# EAGLE design samd21_sensorhub_Lite_TQFP32_1.2.0_feb2023 (EAGLE 9.6.2)
MODEL: SensorHub Lite; VERSION: V1.1.2 Feb 2023

## Sheet 1 of 2
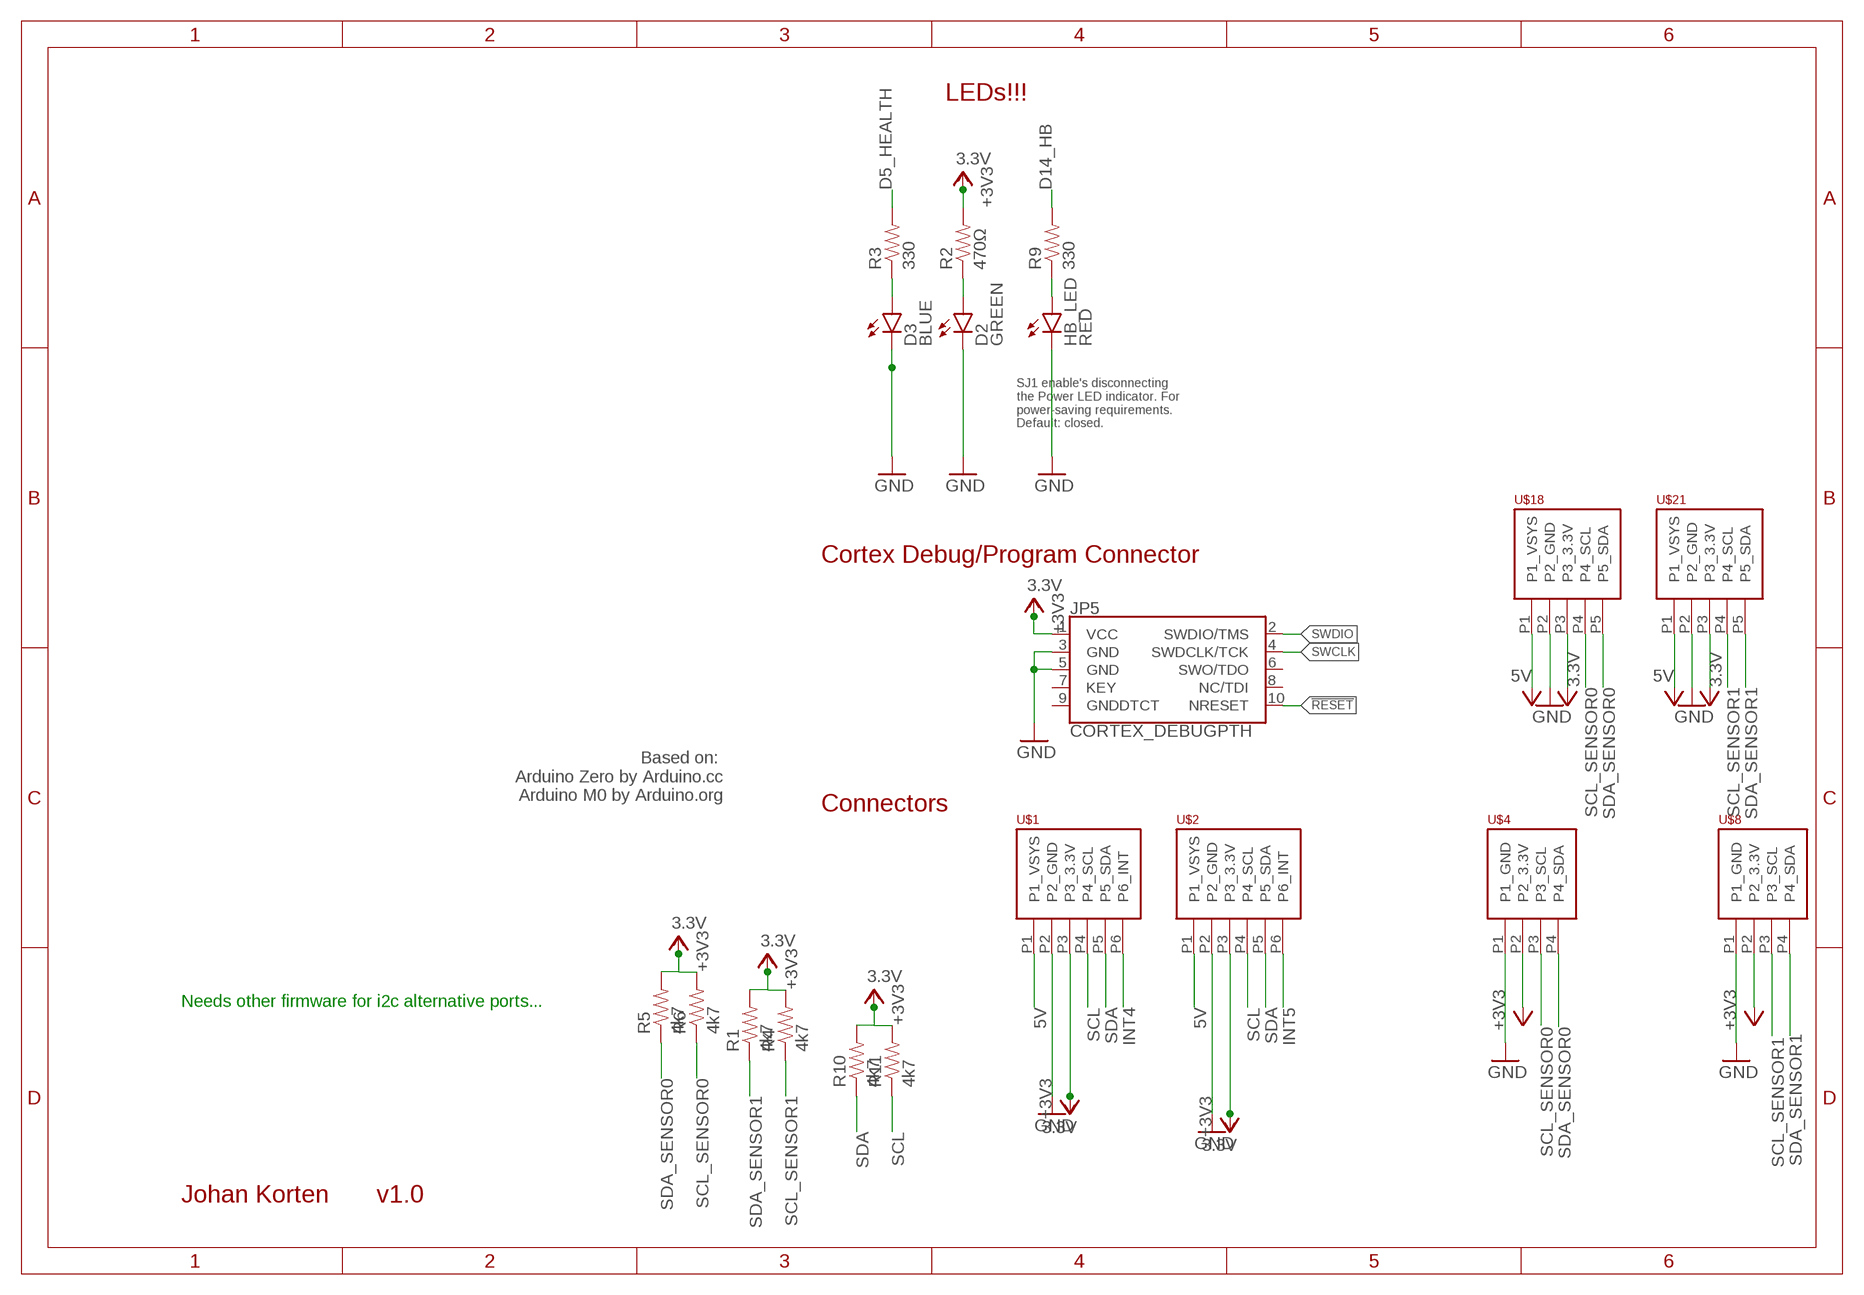
[diagram p0: schematic, sheet 1]

### Parts
D2  GREEN  LED-RED0603  [LED-0603]
D3  BLUE  LED-BLUE0603  [LED-0603]
HB_LED  RED  LED-RED0603  [LED-0603]
JP5  CORTEX_DEBUGPTH  [2X5-PTH-1.27MM]
R1  4k7  330OHM1/10W1%(0603)  [0603-RES]
R2  470Ω  330OHM1/10W1%(0603)  [0603-RES]
R3  330  330OHM1/10W1%(0603)  [0603-RES]
R4  4k7  330OHM1/10W1%(0603)  [0603-RES]
R5  4k7  330OHM1/10W1%(0603)  [0603-RES]
R6  4k7  330OHM1/10W1%(0603)  [0603-RES]
R9  330  330OHM1/10W1%(0603)  [0603-RES]
R10  4k7  330OHM1/10W1%(0603)  [0603-RES]
R11  4k7  330OHM1/10W1%(0603)  [0603-RES]
U$1  PHOENIX_PTSM_M6_TH_I2CPPANGLE  [PTSM_M6_THRHOLE]
U$2  PHOENIX_PTSM_M6_TH_I2CPPANGLE  [PTSM_M6_THRHOLE]
U$4  PHOENIX_PTSM_M4_THANGLE  [PTSM_M4_TH]
U$8  PHOENIX_PTSM_M4_THANGLE  [PTSM_M4_TH]
U$18  PHOENIX_PTSM_M5_TH_I2C++  [PTSM_M5_THRHOLE]
U$21  PHOENIX_PTSM_M5_TH_I2C++  [PTSM_M5_THRHOLE]

### Nets
3.3V [power]: JP5.1(VCC) R1.2 R2.2 R4.2 R5.2 R6.2 R10.2 R11.2 U$1.P3(P3_3.3V) U$2.P3(P3_3.3V) U$4.P2(P2_3.3V) U$8.P2(P2_3.3V) U$18.P3(P3_3.3V) U$21.P3(P3_3.3V) ; supply symbol labelled +3V3 ; also sheet 2
5V [power]: U$1.P1(P1_VSYS) U$2.P1(P1_VSYS) U$18.P1(P1_VSYS) U$21.P1(P1_VSYS) ; supply symbol labelled +5V ; also sheet 2
!RESET: JP5.10(NRESET) ; also sheet 2
D5_HEALTH: R3.2 ; also sheet 2
D5_HEALTH_LED: D3.A R3.1
D14_HB: R9.2 ; also sheet 2
D14_HB_LED: HB_LED.A R9.1
GND [ground]: D2.C D3.C HB_LED.C JP5.3(GND) JP5.5(GND) U$1.P2(P2_GND) U$2.P2(P2_GND) U$4.P1(P1_GND) U$8.P1(P1_GND) U$18.P2(P2_GND) U$21.P2(P2_GND) ; also sheet 2
INT4: U$1.P6(P6_INT) ; also sheet 2
INT5: U$2.P6(P6_INT) ; also sheet 2
N$5: D2.A R2.1
SCL: R11.1 U$1.P4(P4_SCL) U$2.P4(P4_SCL) ; also sheet 2
SCL_SENSOR0: R6.1 U$4.P3(P3_SCL) U$18.P4(P4_SCL) ; also sheet 2
SCL_SENSOR1: R4.1 U$8.P3(P3_SCL) U$21.P4(P4_SCL) ; also sheet 2
SDA: R10.1 U$1.P5(P5_SDA) U$2.P5(P5_SDA) ; also sheet 2
SDA_SENSOR0: R5.1 U$4.P4(P4_SDA) U$18.P5(P5_SDA) ; also sheet 2
SDA_SENSOR1: R1.1 U$8.P4(P4_SDA) U$21.P5(P5_SDA) ; also sheet 2
SWCLK: JP5.4(SWDCLK/TCK) ; also sheet 2
SWDIO: JP5.2(SWDIO/TMS) ; also sheet 2
Unconnected: JP5.6(SWO/TDO) JP5.7(KEY) JP5.8(NC/TDI) JP5.9(GNDDTCT)

### Notes on the sheet
- LEDs!!!
- SJ1 enable's disconnecting
  the Power LED indicator. For
  power-saving requirements.
  Default: closed.
- Cortex Debug/Program Connector
- Based on: 
  Arduino Zero by Arduino.cc
  Arduino M0 by Arduino.org
- Connectors
- Needs other firmware for i2c alternative ports...
- Johan Korten | v1.0

## Sheet 2 of 2: Controller SAMD21 based on Adafruit Feather M0 Express
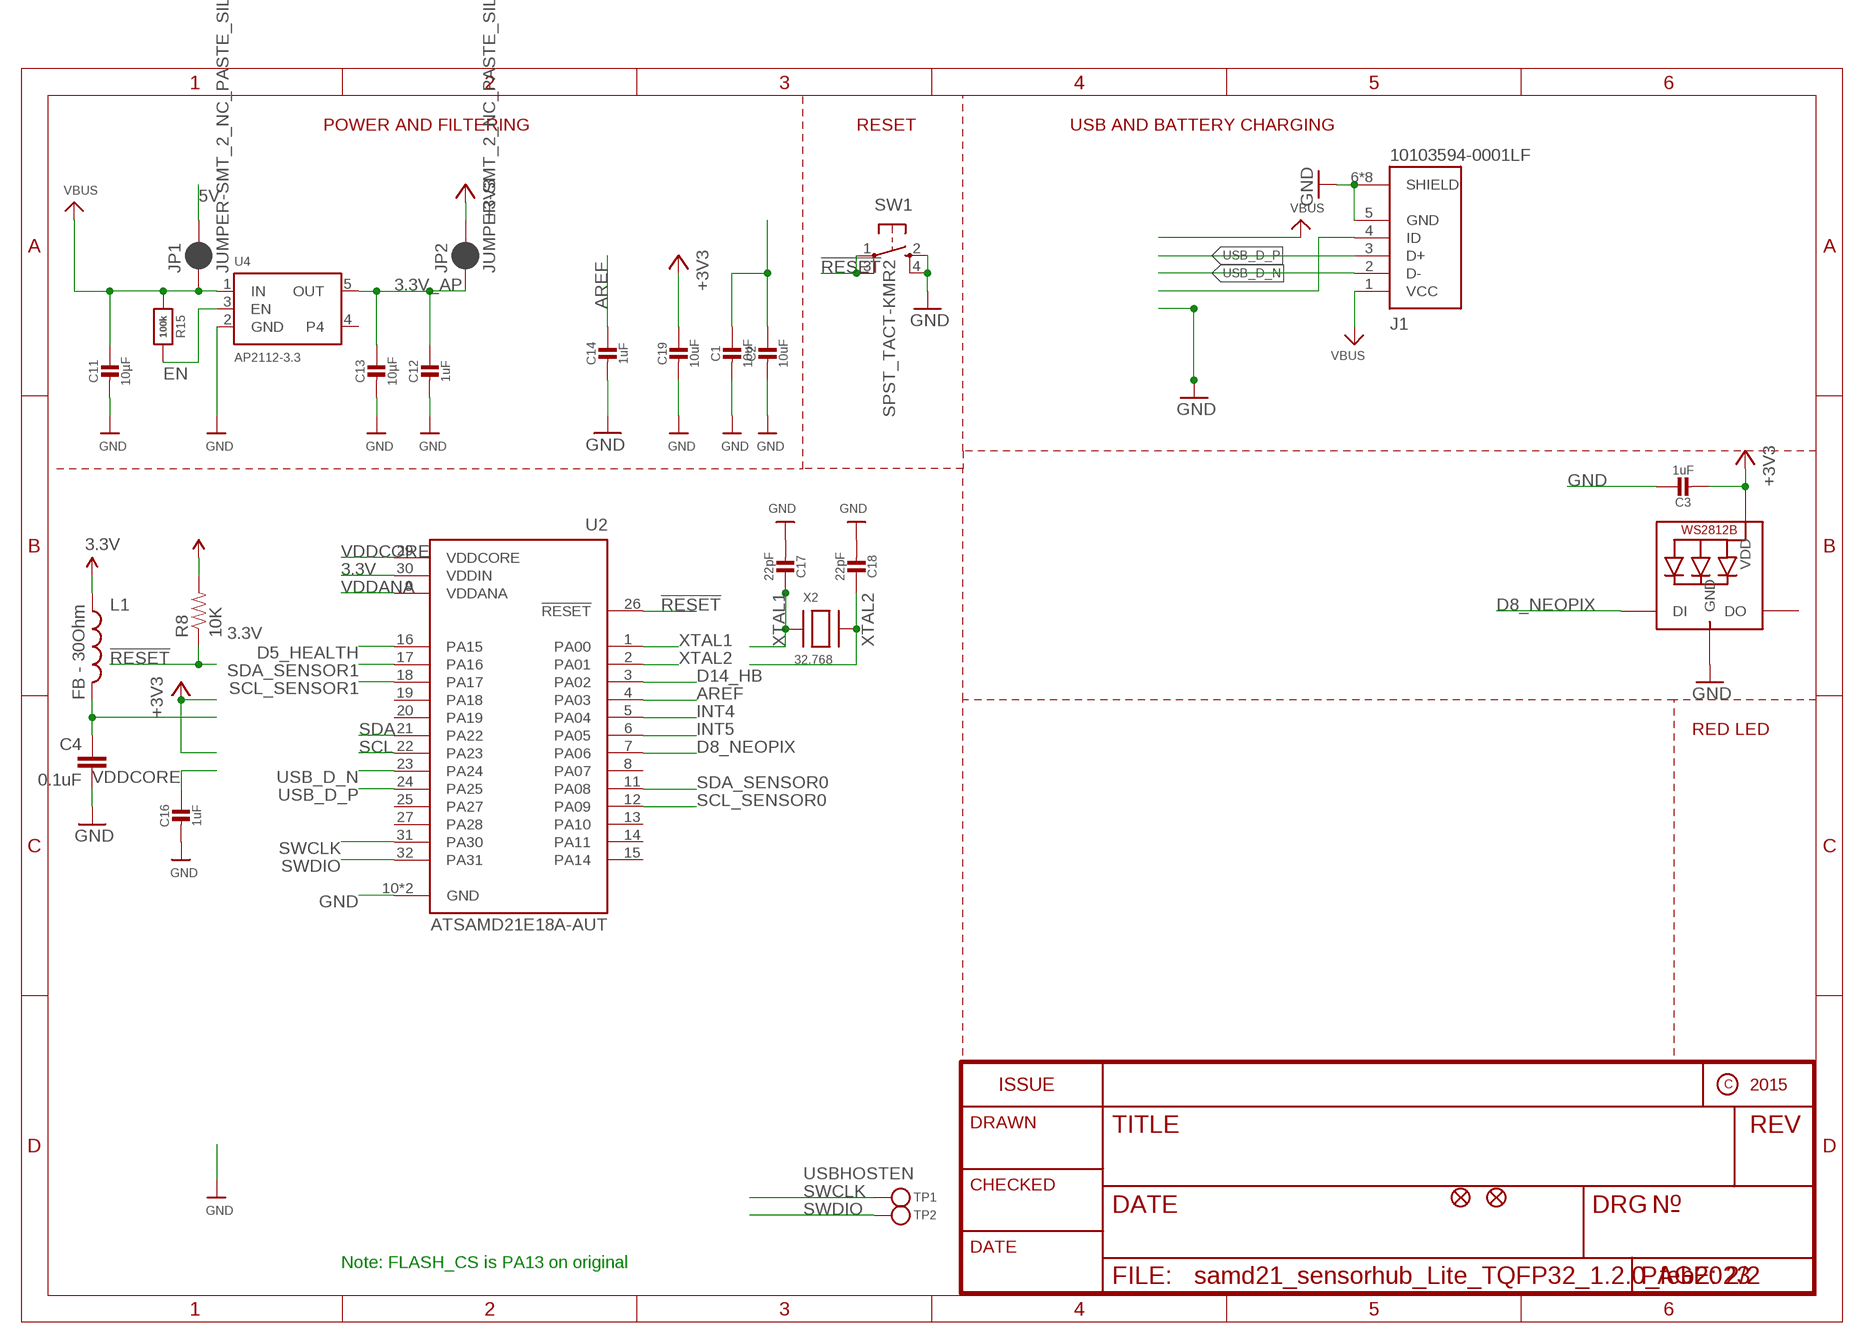
[diagram p1: schematic, sheet 2]

### Parts
C1  10uF  CAP_CERAMIC0805-NOOUTLINE  [0805-NO]
C2  10uF  CAP_CERAMIC0805-NOOUTLINE  [0805-NO]
C3  1uF  CAP_CERAMIC0603_NO  [0603-NO]
C4  0.1uF  0.1UF-16V(+-10%)(0402)  [0402-CAP]
C11  10µF  CAP_CERAMIC0805-NOOUTLINE  [0805-NO]
C12  1uF  CAP_CERAMIC0603_NO  [0603-NO]
C13  10µF  CAP_CERAMIC0805-NOOUTLINE  [0805-NO]
C14  1uF  CAP_CERAMIC0603_NO  [0603-NO]
C16  1uF  CAP_CERAMIC0603_NO  [0603-NO]
C17  22pF  CAP_CERAMIC0603_NO  [0603-NO]
C18  22pF  CAP_CERAMIC0603_NO  [0603-NO]
C19  10uF  CAP_CERAMIC0805-NOOUTLINE  [0805-NO]
J1  10103594-0001LF  [AMPHENOL_10103594-0001LF]
JP1  JUMPER-SMT_2_NC_PASTE_SILK  [SMT-JUMPER_2_NC_PASTE_SILK]
JP2  JUMPER-SMT_2_NC_PASTE_SILK  [SMT-JUMPER_2_NC_PASTE_SILK]
L1  FB - 30Ohm  INDUCTOR0603  [0603]
LED1  WS2812B3535  [LED3535]
R8  10K  10KOHM-1/10W-1%(0603)0603  [0603-RES]
R15  100k  RESISTOR_0603_NOOUT  [0603-NO]
SW1  SPST_TACT-KMR2  [KMR2]
TP1  TESTPOINTROUND1.5MM  [TESTPOINT_ROUND_1.5MM]
TP2  TESTPOINTROUND1.5MM  [TESTPOINT_ROUND_1.5MM]
U2  ATSAMD21E18A-AUT  [QFP80P900X900X120-32N]
U4  AP2112-3.3  VREG_SOT23-5  [SOT23-5]
U$34  FIDUCIAL""  [FIDUCIAL_1MM]
U$35  FIDUCIAL""  [FIDUCIAL_1MM]
X2  32.768  XTAL-3.2X1.5  [XTAL3215]

### Nets
3.3V [power]: C3.2 C19.1 JP2.2 L1.1 LED1.2(VDD) R8.2 U2.30(VDDIN) ; supply symbol labelled +3V3 ; also sheet 1
3.3V_AP [power]: C12.1 C13.1 JP2.1 U4.5(OUT)
5V [power]: C1.1 C2.1 JP1.2 ; also sheet 1
!RESET: R8.1 SW1.1(P) SW1.3(P1) U2.26(!RESET) ; also sheet 1
AREF [power]: C14.1 U2.4(PA03)
D5_HEALTH: U2.16(PA15) ; also sheet 1
D8_NEOPIX: LED1.1(DI) U2.7(PA06)
D14_HB: U2.3(PA02) ; also sheet 1
EN: R15.2 U4.3(EN)
GND [ground]: C1.2 C2.2 C3.1 C4.2 C11.2 C12.2 C13.2 C14.2 C16.2 C17.2 C18.2 C19.2 J1.5(GND) J1.6(SHIELD) J1.7(SHIELD) J1.8(SHIELD) J1.9(SHIELD) J1.10(SHIELD) J1.11(SHIELD) J1.S1(SHIELD) J1.S2(SHIELD) LED1.4(GND) SW1.2(S) SW1.4(S1) U2.10(GND) U2.28(GND) U4.2(GND) ; also sheet 1
INT4: U2.5(PA04) ; also sheet 1
INT5: U2.6(PA05) ; also sheet 1
N$8: J1.4(ID)
SCL: U2.22(PA23) ; also sheet 1
SCL_SENSOR0: U2.12(PA09) ; also sheet 1
SCL_SENSOR1: U2.18(PA17) ; also sheet 1
SDA: U2.21(PA22) ; also sheet 1
SDA_SENSOR0: U2.11(PA08) ; also sheet 1
SDA_SENSOR1: U2.17(PA16) ; also sheet 1
SWCLK: TP1.P$1 U2.31(PA30) ; also sheet 1
SWDIO: TP2.P$1 U2.32(PA31) ; also sheet 1
USB_D_N [usb]: J1.2(D-) U2.23(PA24)
USB_D_P [usb]: J1.3(D+) U2.24(PA25)
VBUS [power]: C11.1 J1.1(VCC) JP1.1 R15.1 U4.1(IN)
VDDANA: C4.1 L1.2 U2.9(VDDANA)
VDDCORE: C16.1 U2.29(VDDCORE)
XTAL1: C17.1 U2.1(PA00) X2.P$1
XTAL2: C18.1 U2.2(PA01) X2.P$2
Unconnected: LED1.3(DO) U2.8(PA07) U2.13(PA10) U2.14(PA11) U2.15(PA14) U2.19(PA18) U2.20(PA19) U2.25(PA27) U2.27(PA28) U4.4

### Notes on the sheet
- POWER AND FILTERING | RESET | USB AND BATTERY CHARGING
- RED LED
- USBHOSTEN
- Note: FLASH_CS is PA13 on original

## Library data of the parts
C1-C3 C11-C14 C16-C19 = microbuilder:CAP_CERAMIC: Ceramic Capacitors For new designs, use the packages preceded by an '_' character since they are more reliable: The following footprints should be used on most boards: _0402 - Standard footprint for regular board layouts _0603 - Standard footprint for regular board layouts _0805 - Standard footprint for regular board layouts _1206 - Standard footprint for regular board layouts For extremely tight-pitch boards where space is at a premium, the following 'micro-pitch' footprints can be used (smaller pads, no silkscreen outline, etc.): _0402MP - Micro-pitch footprint for very dense/compact boards _0603MP - Micro-pitch footprint for very dense/compact boards _0805MP - Micro-pitch footprint for very dense/compact boards _1206MP - Micro-pitch footprint for very dense/compact boards
C4 = SparkFun-Capacitors:0.1UF-16V(+-10%)(0402); PROD_ID: CAP-12416
D2 = SparkFun-LED:LED-RED: Assorted Red LEDs LilyPad 1206- DIO-09912 1206- DIO-00809 0603- DIO-00819 "SMART" means more efficient and expensive; PROD_ID: DIO-00819; VALUE: RED
D3 = SparkFun-LED:LED-BLUE: Blue LEDs for production use Various blue LEDs stocked by SparkFun production 0603 - DIO-08575 Rebel - DIO-09553 1206 - DIO-09911; PROD_ID: DIO-08575
HB_LED = SparkFun-LED:LED-RED: Assorted Red LEDs LilyPad 1206- DIO-09912 1206- DIO-00809 0603- DIO-00819 "SMART" means more efficient and expensive; PROD_ID: DIO-00819
J1 = 10103594-0001LF:10103594-0001LF: USB - micro B USB 2.0 Receptacle Connector 5 Position Surface Mount, Right Angle; Through Hole Check availability <https://pricing.snapeda.com/parts/10103594-0001LF/AMPHENOL%20ICC%20/%20FCI/view-part?ref=eda>; AVAILABILITY: In Stock; DESCRIPTION: Micro USB 2.0, Input Output Connectors, B TYPE RECEPTACLE; MF: AMPHENOL ICC / FCI; MP: 10103594-0001LF; PACKAGE: None; PRICE: None; PURCHASE-URL: https://pricing.snapeda.com/search/part/10103594-0001LF/?ref=eda
JP1 JP2 = SparkFun-Jumpers:JUMPER-SMT_2_NC_PASTE: Normally closed solder jumper This jumper has an aperture in the stencil to allow solder paste to bridge the split in the wire so it's normally closed (NC). Wick off the solder to open the connection. Reapply solder to reclose the connection.
JP5 = samd21-temp:CORTEX_DEBUG: Cortex Debug Connector Datasheet <http://infocenter.arm.com/help/topic/com.arm.doc.faqs/attached/13634/cortex_debug_connectors.pdf>
L1 = SparkFun-Passives:INDUCTOR: Inductors Basic Inductor/Choke - 0603 and 1206. Footprints are not proven and vary greatly between part numbers. INDUCTOR POWER 3.3UH 4.0A SMD 0.197" L x 0.197" W x 0.177" H (5.00mm x 5.00mm x 4.50mm); PROD_ID: RES-07859
LED1 = microbuilder:WS2812B
R1 R2 R4-R6 R10 R11 = SparkFun-Resistors:330OHM1/10W1%(0603): RES-00818; PROD_ID: RES-00818; VALUE: 330
R3 R9 = SparkFun-Resistors:330OHM1/10W1%(0603): RES-00818; PROD_ID: RES-00818
R8 = SparkFun-Resistors:10KOHM-1/10W-1%(0603): RES-00824; PROD_ID: RES-00824
R15 = microbuilder:RESISTOR: Resistors For new designs, use the packages preceded by an '_' character since they are more reliable: The following footprints should be used on most boards: _0402 - Standard footprint for regular board layouts _0603 - Standard footprint for regular board layouts _0805 - Standard footprint for regular board layouts _1206 - Standard footprint for regular board layouts For extremely tight-pitch boards where space is at a premium, the following 'micro-pitch' footprints can be used (smaller pads, no silkscreen outline, etc.): _0402MP - Micro-pitch footprint for very dense/compact boards _0603MP - Micro-pitch footprint for very dense/compact boards _0805MP - Micro-pitch footprint for very dense/compact boards _1206MP - Micro-pitch footprint for very dense/compact boards
SW1 = adafruit:SPST_TACT: SMT 6mm switch, EVQQ2 series http://www.ladyada.net/library/eagle
TP1 TP2 = microbuilder:TESTPOINT: Test Point Various test points for characterisation and PCB testing TESTPOINT_SMT - Compact Surface Mount Test Point [Digikey: 5016KTR-ND]
U2 = ATSAMD21E18A-AUT:ATSAMD21E18A-AUT: ARM Cortex-M0+ SAM D21E Microcontroller IC 32-Bit 48MHz 256KB (256K x 8) FLASH 32-TQFP (7x7) Check availability <https://pricing.snapeda.com/parts/ATSAMD21E18A-AU/Microchip/view-part?ref=eda>; AVAILABILITY: In Stock; DESCRIPTION: ARM® Cortex®-M0+ SAM D21E, Functional Safety (FuSa) Microcontroller IC 32-Bit Single-Core 48MHz 256KB (256K x 8) FLASH 32-TQFP (7x7); MF: Microchip; MP: ATSAMD21E18A-AU; PACKAGE: TQFP-32 Microchip; PRICE: None; PURCHASE-URL: https://pricing.snapeda.com/search/part/ATSAMD21E18A-AU/?ref=eda
U4 = microbuilder:VREG_SOT23-5: SOT23-5 Fixed Voltage Regulators Part Current Out V Out V In V Dropout θJA (°C/W) TJ (°C) Digikey Part No. ADP121 150mA 3.3V 3.4-5.5V 0.09V @ 150mA -- -- ADP121-AUJZ33R7CT-ND ADP121 150mA 3.0V 3.1-5.5V 0.09V @ 150mA -- -- ADP121-AUJZ30R7CT-ND ADP122 300mA 3.3V 3.4-5.5V 0.085V @ 300mA -- -- ADP122AUJZ-3.3-R7CT-ND ADP1712 300mA 3.3V 3.5-5.5V 0.17V @ 300mA -- -- ADP1712AUJZ-3.3-R7TR-ND AP7311 (Low Cost) 150mA 3.3V 3.5-6V 0.15V @ 150mA -- -- AP7311-33WG-7DICT-ND LD39015M18R 150mA 1.8V 1.9V-5.5V 0.08V @ 100mA -- -- 497-6977-1-ND LP2985A-33DBVR 150mA 3.3V 3.3-16V 0.28V @ 150mA 206 150 296-18479-1-ND MCP1824T-3302E/OT 300mA 3.3V 3.5V-6V 0.2V @ 300mA -- -- MCP1824T-3302E/OTCT-ND MIC5205-2.5YM5 TR 150mA 2.5V 2.7-16V 0.165V @ 150mA -- -- 576-1257-2-ND MIC5205-3.0YM5 TR 150mA 3.0V 3.2V-16V 0.165V @ 150mA -- -- 576-1258-2-ND MIC5205-3.3YM5 TR 150mA 3.3V 3.5V-16V 0.165V @ 150mA -- -- 576-1259-2-ND TPS780330220 150mA 3.3V+2.2V 3.6-5.5V 250mV Max -- -- 296-23332-1-ND TDA3663/N1,135 100mA 3.3V 3.5-45V 0.18V @ 50mA -- -- 568-5343-1-ND Max operating temp can be calculated using θJA, TJ (max junction temperature), and power in watts. Set the "Maximum Ambient Temperature" until it reaches TJ ("Max Junction Temperature"), which is the absolute limit for safe use of the regulator: Heat Sink Temperature Calculator <http://www.daycounter.com/Calculators/Heat-Sink-Temperature-Calculator.phtml> For example, With 12V source into a 3.3V LP2985 and a 30mA load, we are dissipating (12V-3.3V) * 0.03A = 0.261W. With a θJA of 206 °C/W, a TJ of 150°C, and 261mW we can safely use the chip without a heat sink up to 75°C (=147.1°C Junction Temperature).
U$1 U$2 = jk_customs:PHOENIX_PTSM_M6_TH_I2CPP
U$4 U$8 = jk_customs:PHOENIX_PTSM_M4_TH
U$18 U$21 = jk_customs:PHOENIX_PTSM_M5_TH: Datasheet Phoenix PTSM 0,5/ 5-HH-2,5-THR R32 <https://www.phoenixcontact.com/online/portal/us?uri=pxc-oc-itemdetail:pid=1778654&library=usen&pdfmode=direct&pdflanguage=en>
U$34 U$35 = microbuilder:FIDUCIAL: Fiducial Alignment Points Various fiducial points for machine vision alignment.; BOM: EXCLUDE
X2 = adafruit2:XTAL: Low cost SMT crystals, no capacitors included http://www.ladyada.net/library/eagle

## Net classes
1 usb: width 0.152 mm, drill 0.254 mm, clearance 0.152 mm
2 ground: width 0.254 mm, drill 0.254 mm, clearance 0.152 mm
3 power: width 0.254 mm, drill 0.254 mm, clearance 0.152 mm

## Board
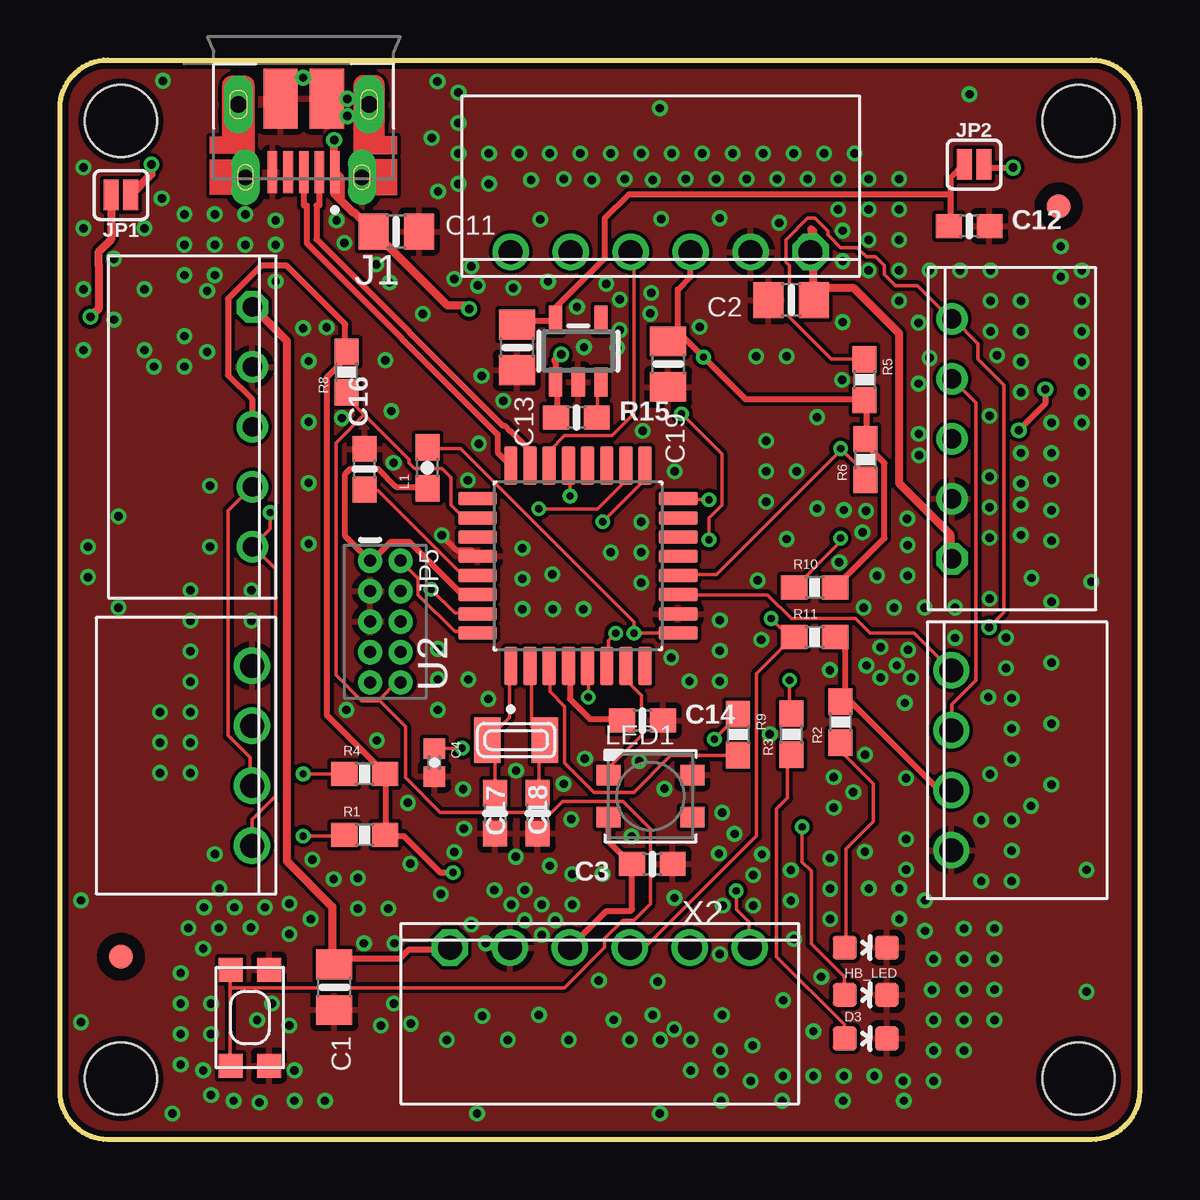
[diagram p2: board, top side]
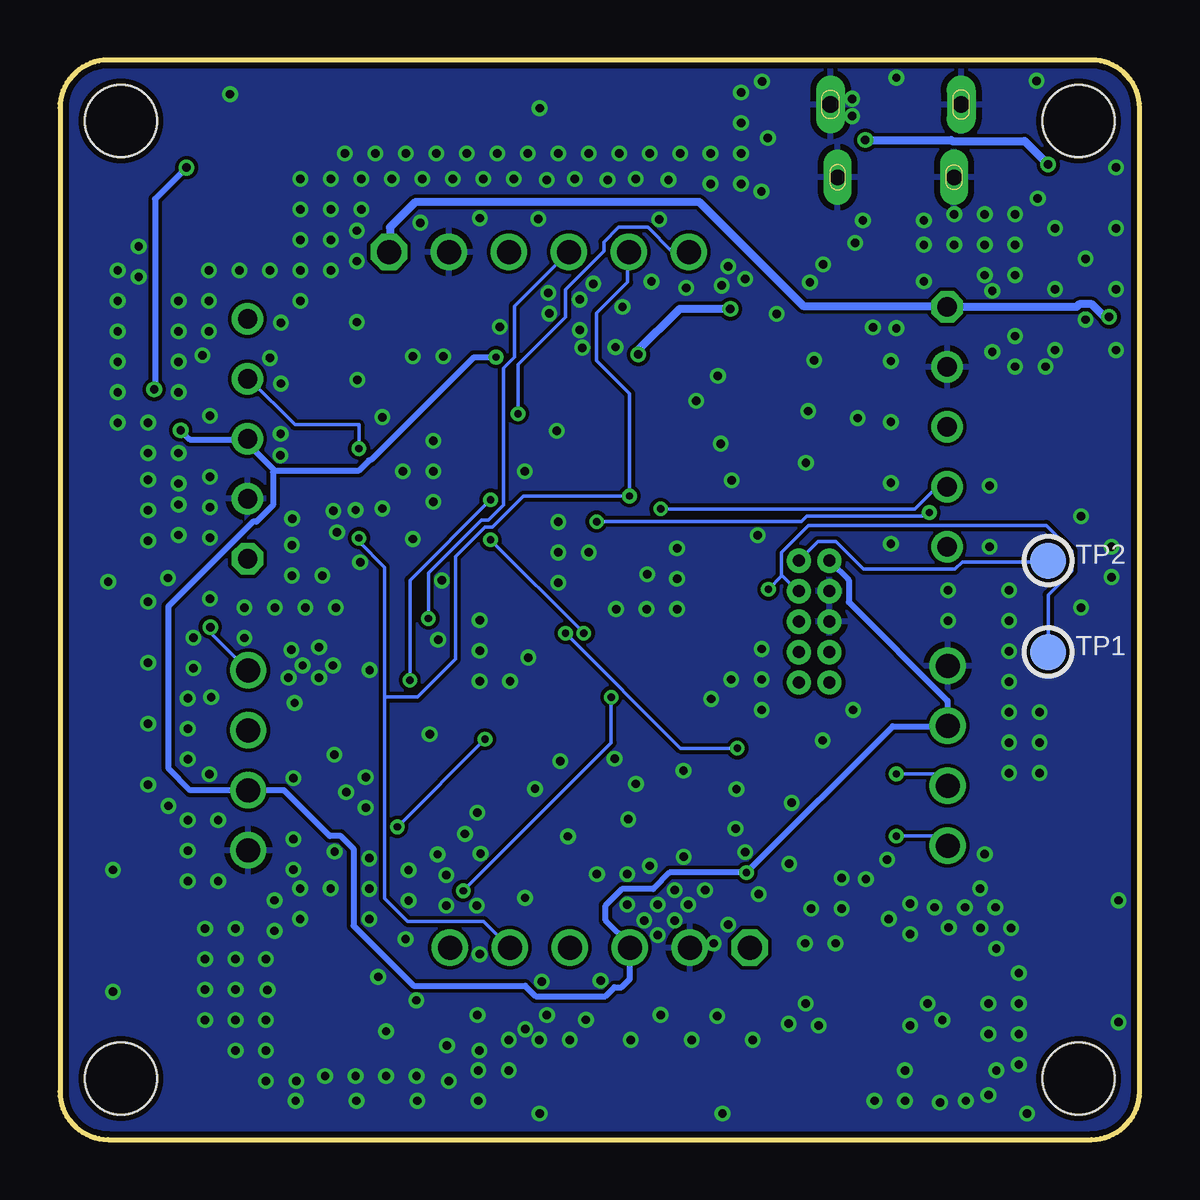
[diagram p3: board, bottom side, seen from below]

Size 45 x 45 mm. Coordinates in mm from the lower left corner, seen from the top.
Outline: 2,45 43,45 arc-90 45,43 45,2 arc-90 43,0 2,0 arc-90 0,2 0,43 arc-90 2,45
Copper layers (1*16): Top 0.035mm / dielectric 1.5mm / Bottom 0.035mm
Design rules "ITEADstudio_DRC_Recent_june2014": minimum track width 6mil, minimum drill 12mil, track to track 6mil, track to pad 6mil, pad to pad 6mil, via to via 6mil, smd to smd 0mil, copper to edge 10mil, drill to drill 10mil, minimum pad ring 10mil, minimum via ring 6mil, stop-mask expansion 2mil, vias tented up to drill 100mil, thermal gap 10mil
Holes 3 mm at 2.54,42.46 2.54,2.54 42.46,2.54 42.46,42.46

### Footprints (pad centres in the part's own frame; a part is rotated, then mirrored left to right if it is on the bottom)
0805-NO = smd 1.24 x 1.5: 1 -0.95,0; 2 0.95,0
0603-NO = smd 1.075 x 1: 1 -0.85,0; 2 0.85,0
0402-CAP = smd 0.85 x 0.9: 1 -0.58,0; 2 0.58,0
LED-0603 = smd 1 x 1: A 0,-0.877; C 0,0.877
AMPHENOL_10103594-0001LF = smd 0.4 x 1.75: 1 -1.3,2.825; 2 -0.65,2.825; 3 0,2.825; 4 0.65,2.825; 5 1.3,2.825 | drill 0.65 pad 0.73 long: 6 -2.425,3.03; 7 2.425,3.03 | drill 0.7 pad 1.2 long: 8 -2.725,0; 9 2.725,0 | smd 1.05 x 2.1 bottom: 10 -2.425,3.03; 11 2.425,3.03 | smd 1.425 x 2.5: S1 -0.963,-0.25; S2 0.963,-0.25
SMT-JUMPER_2_NC_PASTE_SILK = smd 0.635 x 1.27: 1 -0.406,0; 2 0.406,0
2X5-PTH-1.27MM = drill 0.508 pad 1: 1 -2.54,-0.635; 2 -2.54,0.635; 3 -1.27,-0.635; 4 -1.27,0.635; 5 0,-0.635; 6 0,0.635; 7 1.27,-0.635; 8 1.27,0.635; 9 2.54,-0.635; 10 2.54,0.635
0603 = smd 1.1 x 1: 1 -0.85,0; 2 0.85,0
LED3535 = smd 1 x 0.85: 1 -1.75,0.875; 2 -1.75,-0.875; 3 1.75,-0.875; 4 1.75,0.875
0603-RES = smd 1.1 x 1: 1 -0.85,0; 2 0.85,0
KMR2 = smd 1 x 1: 1 2,0.8; 2 2,-0.8; 3 -2,0.8; 4 -2,-0.8
TESTPOINT_ROUND_1.5MM = smd 1.5 x 1.5: P$1 0,0
QFP80P900X900X120-32N = smd 1.6 x 0.55: 1 -4.18,2.8; 2 -4.18,2; 3 -4.18,1.2; 4 -4.18,0.4; 5 -4.18,-0.4; 6 -4.18,-1.2; 7 -4.18,-2; 8 -4.18,-2.8; 17 4.18,-2.8; 18 4.18,-2; 19 4.18,-1.2; 20 4.18,-0.4; 21 4.18,0.4; 22 4.18,1.2; 23 4.18,2; 24 4.18,2.8 | smd 0.55 x 1.6: 9 -2.8,-4.18; 10 -2,-4.18; 11 -1.2,-4.18; 12 -0.4,-4.18; 13 0.4,-4.18; 14 1.2,-4.18; 15 2,-4.18; 16 2.8,-4.18; 25 2.8,4.18; 26 2,4.18; 27 1.2,4.18; 28 0.4,4.18; 29 -0.4,4.18; 30 -1.2,4.18; 31 -2,4.18; 32 -2.8,4.18
SOT23-5 = smd 0.55 x 1.2: 1 -0.95,-1.3; 2 0,-1.3; 3 0.95,-1.3; 4 0.95,1.3; 5 -0.95,1.3
PTSM_M6_THRHOLE = drill 1 octagon: P1 6.25,1 | drill 1: P2 3.75,1; P3 1.25,1; P4 -1.25,1; P5 -3.75,1; P6 -6.25,1
PTSM_M4_TH = drill 1: P1 3.75,1; P2 1.25,1; P3 -1.25,1; P4 -3.75,1
PTSM_M5_THRHOLE = drill 0.8 octagon: P1 5,1 | drill 0.8: P2 2.5,1; P3 0,1; P4 -2.5,1; P5 -5,1
FIDUCIAL_1MM = smd 1 x 1: 1 0,0
XTAL3215 = smd 1.1 x 1.9: P$1 1.2,0; P$2 -1.2,0

### Placement (x,y rotation side)
C1  11.43,6.35 270 top
C2  30.48,35 180 top
C3  24.69,11.48 180 top
C4  15.61,15.71 270 top
C11  14.02,37.85 0 top
C12  37.9,38.07 0 top
C13  19.05,33.02 270 top
C14  24.28,17.46 0 top
C16  12.7,27.94 90 top
C17  18.14,13.6 270 top
C18  19.91,13.6 270 top
C19  25.35,32.32 270 top
D2  33.59,8 270 top
D3  33.59,4.21 270 top
HB_LED  33.59,6.03 270 top
J1  10.16,43.14 180 top
JP1  2.54,39.37 180 top
JP2  38.1,40.64 0 top
JP5  13.56,21.59 270 top
L1  15.32,28 90 top
LED1  24.61,14.31 0 top
R1  12.7,12.7 0 top
R2  32.54,17.4 90 top
R3  30.49,16.89 90 top
R4  12.7,15.24 0 top
R5  33.54,31.67 270 top
R6  33.58,28.35 90 top
R8  11.95,31.99 90 top
R9  28.27,16.88 270 top
R10  31.46,23.01 0 top
R11  31.46,20.94 0 top
R15  21.53,30.1 0 top
SW1  7.91,5.08 90 top
TP1  3.81,20.32 0 bottom
TP2  3.81,24.13 0 bottom
U2  21.59,23.91 90 top
U4  21.6,32.87 0 top
U$1  22.5,9 180 top
U$2  25.04,36 0 top
U$4  36.15,15.81 270 top
U$8  9,16 90 top
U$18  36.18,29.21 270 top
U$21  9.02,29.71 90 top
U$34  41.63,38.9 0 top
U$35  2.54,7.62 0 top
X2  19.01,16.65 180 top

### Tracks (layer width: path | path; a pad name or v marks a point on that pad's centre or on a via)
3.3V  (via drill 0.3, 0.35)
  Top 0.254: R11.2 32.38,20.88 32.72,20.55 32.72,18.43 R2.2 32.61,18.21 32.99,18.21 36.58,14.63 37.11,14.63 U$4.P2 | R10.2 32.38,23.09 34.37,25.07 34.37,28.19 33.68,28.88 33.68,29.11 R6.2 33.6,29.26 33.6,30.79 R5.2 33.45,30.86 28.57,30.86 v26.82,32.61 25.83,33.6 C19.1 25.38,33.3 25.76,33.68 25.76,35.43 26.29,35.97 26.29,36.96 U$2.P3 | JP2.2 38.63,40.51 v39.73,40.51 | v41.07,31.27 41.07,30.67 v39.97,29.57 | U$1.P3 22.78,9.53 23.77,9.53 23.85,9.6 23.85,11.35 C3.2 23.77,11.51 22.86,12.42 22.86,13.41 LED1.2 | L1.1 15.32,27.2 14.02,27.2 13.26,27.96 12.12,27.96 11.89,27.74 11.89,25.15 12.88,24.16 JP5.1 13.03,24.16 13.79,24.92 14.55,24.92 16.69,22.78 17.37,22.78 U2.30 | U$21.P3 8,29.72 8,30.86 7.01,31.85 7.01,35.05 8.38,36.42 9.45,36.42 11.89,33.98 11.89,32.92 R8.2 11.89,32.77 11.89,32.54 11.12,31.77 11.12,17.68 13.49,15.32 R4.2 13.56,15.24 13.56,12.72 R1.2 13.64,12.65 14.33,12.65 15.85,11.12 v16.38,11.12
  Bottom 0.254: 36.04,27.89 32.54,27.89 32.12,28.31 32,28.35 27.74,32.61 v26.82,32.61 | 36.04,27.89 37.11,28.96 37.11,29.18 | 37.11,29.18 U$18.P3 | 36.04,27.89 36.12,27.81 36.12,26.44 36.8,25.76 36.96,25.76 40.49,22.23 40.49,15.48 39.57,14.56 U$4.P2 37.03,14.55 35.66,14.55 33.76,12.65 33.3,12.65 32.77,12.12 32.77,8.91 30.26,6.41 25.61,6.41 25.17,5.97 22.27,5.97 21.89,6.35 21.59,6.35 21.25,6.69 U$1.P3 21.25,8.14 22.25,9.14 22.25,9.75 21.57,10.44 20.27,10.44 19.58,11.12 v16.38,11.12 10.29,17.22 8.08,17.22 U$8.P2 8,17.3 8,18.29 12.12,22.4 12.12,23.32 12.88,24.08 JP5.1 | v39.73,40.51 41.03,39.2 41.03,31.3 v41.07,31.27 | v39.97,29.57 39.59,29.18 37.11,29.18
3.3V_AP
  Top 0.254: C13.1 19.05,33.98 19.2,34.14 20.65,34.14 U4.5 20.65,34.29 20.65,34.67 22.71,36.73 22.71,38.41 23.7,39.4 37.11,39.4 | 37.11,39.4 37.11,40.08 37.64,40.62 JP2.1 | 37.11,39.4 37.11,38.1 C12.1
5V  (via drill 0.35)
  Top 0.254: U$1.P1 16.23,7.92 14.55,7.92 14.17,7.54 11.51,7.54 C1.1
  Top 0.33: U$2.P1 31.32,37.95 31.39,37.87 31.39,35.59 C2.1 31.55,35.51 33.07,35.51 34.98,33.6 34.98,27.36 37.11,25.22 37.11,24.23 U$18.P1 | C1.1 11.35,7.39 11.35,9.7 9.45,11.61 9.45,33.3 8.08,34.67 U$21.P1 | JP1.2 2.13,37.51 1.6,36.98 1.6,36.45 1.62,36.43 1.62,34.64 v1.27,34.29
  Bottom 0.33: U$2.P1 31.24,38.02 30.18,39.09 18.36,39.09 14.02,34.75 8.08,34.75 U$21.P1 2.63,34.7 2.52,34.82 1.98,34.82 1.45,34.29 v1.27,34.29
!RESET
  Top 0.152: 7.09,6.33 7.09,7.01 SW1.1 | 7.09,6.33 7.09,3.12 SW1.3 | 12.69,30.21 14.55,28.35 14.55,28.19 14.78,27.96 15.93,27.96 16.31,27.58 16.31,26.44 16.76,25.98 17.37,25.98 U2.26 | 12.69,30.21 11.96,30.94 11.96,31.09 R8.1 | JP5.10 14.02,19.05 13.3,18.33 | 13.3,18.33 13.26,18.29 12.57,18.29 11.51,19.36 11.51,29.03 12.69,30.21 | 7.09,6.33 21.03,6.33 22.71,8 22.71,8.38 23.47,9.14 23.93,9.14 24.61,9.83 24.61,12.95 23.47,14.1 20.95,14.1 20.5,13.64 15.85,13.64 14.4,15.09 14.4,17.22 13.3,18.33
AREF
  Top 0.254: C14.1 23.39,17.53 22.1,17.53 21.26,18.36 21.26,19.66 U2.4
D5_HEALTH  (via drill 0.3)
  Top 0.152: R3.2 30.42,17.82 v30.42,19.15 | v27.05,26.67 25.83,26.67 U2.16
  Bottom 0.152: v30.42,19.15 30.42,23.3 v27.05,26.67
D5_HEALTH_LED
  Top 0.152: D3.A 32.69,4.27 32.69,4.8 29.87,7.62 29.87,13.78 30.33,14.24 30.33,15.97 R3.1
D8_NEOPIX
  Top 0.152: LED1.1 22.94,15.24 22.94,15.54 24.23,16.84 24.23,18.52 23.62,19.13 23.62,19.66 U2.7
D14_HB
  Top 0.152: R9.2 28.27,16 25.45,16 23.93,14.48 22.25,14.48 21.03,15.7 21.03,18.06 20.42,18.67 20.42,19.66 U2.3
D14_HB_LED  (via drill 0.3)
  Top 0.152: HB_LED.A 32.69,6.1 32.69,6.78 31.32,8.15 31.32,11.2 30.94,11.58 v30.94,13.03 | v27.28,16.69 28.27,17.68 R9.1
  Bottom 0.152: v30.94,13.03 v27.28,16.69
EN
  Top 0.152: R15.2 22.4,30.1 22.4,31.47 22.48,31.55 U4.3
GND  (via drill 0.35)
  Top 0.254: U2.28 17.16,24.56 16.54,24.56 16.33,24.76 16.33,24.77 v15.91,25.18
  other vias: 21.55,34.71 29.98,38.21 27.36,40.04 24.71,40.01 22.17,40.01 19.63,40.01 18.9,35.5 11.53,38.32 8.99,38.32 8.99,35.78 11.11,33.86 9.56,9.83 12.42,10.9 14.61,11.49 17.75,8.18 13.94,8.18 14.63,4.83 10.36,32.45 17.14,36.4 13.18,36.47 40.06,25.2 33.62,19.76 27.47,11.91 32.26,15.1 30.47,11.23 32.11,11.72 34.99,10.46 30.15,5.8 25.6,4.6 19.96,5.19 17.6,5.14 8.22,4.98 8.32,1.54 6.63,8.81 36.35,6.24 35.14,2.44 36.06,8.7 39.67,15.85 35.22,18.2 34.06,23.51 38.7,18.44 32.68,26.24 32.63,34.07 36.25,32.58 35.8,29.41 28.89,11.02 27.51,7.72 24.92,6.58 24.7,5.18 27.6,5.18 31.41,4.51 31.74,6.78 30.59,8.36 33.5,22.17 34.77,22.17 34.89,19.76 35.33,23.51 35.33,24.78 33.6,26.2 33.45,25.31 35.27,15.06 35.27,12.52 33.55,12 28.87,3.91 30.14,2.64 31.41,2.64 32.68,2.64 33.95,2.64 27.52,3.71 28.79,2.44 25.62,10.07 23.08,4.99 22.47,6.63 20.08,8.52 21.35,9.79 22.62,11.06 20.42,11.4 19,11.79 15.88,10.22 17.14,8.95 13.69,9.63 12.42,9.63 10.52,11.67 9.56,8.56 12.67,8.18 10.45,9.19 11.4,10.86 6.64,10.46 9.56,4.75 13.37,4.75 13.92,5.66 8.84,5.66 6.3,5.66 5.03,4.39 5.03,5.66 6.3,4.39 5.03,6.93 5.36,8.81 5.97,7.96 7.95,8.84 6.01,9.68 7.28,9.68 8.55,9.68 5.18,32.22 6.45,36.03 5.18,33.49 3.91,32.22 5.18,36.03 7.72,37.3 6.45,37.3 7.72,38.57 6.45,38.57 5.18,38.57 15.49,41.74 16.61,43.65 16.61,42.38 16.61,41.11 16.61,39.84 15.76,39.52 17.88,41.11 19.15,41.11 20.42,41.11 17.88,39.84 21.69,41.11 22.96,41.11 24.23,41.11 25.5,41.11 26.77,41.11 28.04,41.11 26.09,40.04 23.55,40.04 21.01,40.04 28.63,40.04 29.31,41.11 30.58,41.11 31.85,41.11 33.12,41.11 29.9,40.04 31.17,40.04 32.44,40.04 33.71,40.04 33.71,38.77 32.44,38.77 33.71,37.5 33.71,36.23 34.98,38.77 34.98,37.5 34.98,36.23 34.98,34.96 36.25,36.23 37.52,36.23 38.79,36.23 38.79,34.96 34.98,40.04 41.72,37.22 40.06,34.96 40.06,32.42 40.06,33.69 38.79,33.69 39.07,32.69 40.06,31.15 41.33,29.88 40.06,28.61 40.06,27.34 35.81,28.52 35.79,31.51 35.32,25.88 36.04,22.17 37.31,22.17 37.31,20.9 39.43,20.92 39.43,19.65 40.06,26.47 40.5,23.41 38.75,25.08 39.67,17.12 39.67,18.39 40.47,13.91 39.67,13.31 38.4,13.31 38.4,10.77 39.67,12.04 39.67,10.77 34.99,9.19 36.06,9.97 35.27,11.25 32.11,10.45 32.11,9.18 30.47,9.96 28.89,9.75 27.62,9.75 6.45,11.9 16.43,11.98 18.11,10.4 19.38,10.4 19.38,9.13 20.65,9.13 20.08,9.79 18.81,9.79 21.35,11.06 10.13,33.82 6.13,32.83 6.13,35.37 8.99,37.3 4.24,39.23 5.18,37.3 0.98,40.53 3.52,37.99 0.98,37.99 2.25,36.72 3.52,35.45 2.25,34.18 0.98,35.45 0.98,32.91 3.52,32.91 6.3,1.85 5.03,3.12 5.97,2.88 7.24,1.61 9.78,1.61 11.05,1.61 9.78,2.88 16.13,4.15 18.67,4.15 21.21,4.15 23.75,4.15 25.02,4.15 26.29,4.15 26.29,2.88 27.56,2.88 27.56,1.61 30.1,1.61 32.64,1.61 35.18,1.61 36.41,2.44 36.41,3.71 37.68,3.71 38.95,4.98 37.68,4.98 36.41,4.98 37.68,6.25 36.41,7.52 37.68,8.79 37.68,7.52 38.95,7.52 38.95,6.25 38.95,8.79 38.77,15.23 32.6,31.66 32.63,36.61 32.63,37.88 20.35,35.76 22.77,35.67 23.23,33.01 24.65,35.29 23.33,35.01 23.33,33.74 17.41,35.6 16.43,35.88 13.74,35.73 11.85,37.38 34.2,20.52 34.2,19.25 35.47,19.25 35.36,20.41 26.67,33.87 24.6,34.43 20.02,38.35 25.06,38.38 27.5,38.4 42.6,32.42 42.6,33.69 42.6,31.15 42.6,29.88 42.6,34.96 41.72,35.95 42.6,36.23 41.33,28.61 37.91,43.57 42.99,23.25 42.79,11.24 42.79,6.16 25.01,1.08 17.39,1.08 0.88,9.97 0.88,4.89 4.69,1.08 25.01,42.99 11.98,43.38 32.49,24.07 32.26,13.83 33.07,14.48 33.57,16.04 4.29,44.13 11.98,42.66 10.13,44.26 15.74,44.11 15.13,34.42 13.56,32.49 13.82,30.37 11.75,30.07 13.91,28.21 17.01,27.48 17.46,29.01 18.48,30.8 21.84,33.03 17.58,31.84 24.3,29.54 25.63,27.85 24.23,25.74 24.23,24.47 22.96,24.47 24.23,23.2 19.28,24.65 19.28,23.38 19.28,22.11 20.55,22.11 21.82,22.11 27.51,21.64 27.51,20.37 27.51,19.1 26.24,19.1 25.2,14.62 29.59,16.89 27.61,13.63 16.8,14.61 14.5,14.03 11.94,17.91 13.21,16.64 15.75,17.91 15.75,19.18 15.75,20.45 17.02,19.18 7.98,21.63 7.98,22.9 5.44,22.9 5.44,21.63 5.44,20.36 5.44,19.09 5.44,17.82 5.44,16.55 5.44,15.28 4.17,15.28 4.17,16.55 4.17,17.82 6.25,24.71 6.25,27.25 2.44,25.98 1.17,24.71 1.17,23.44 2.44,22.17 10.36,29.91 10.36,27.37 10.36,24.83 20.52,23.56 29.44,27.85 29.44,29.12 30.71,27.85 29.44,26.58 31.56,30.11 29.02,32.65 30.29,32.65 31.56,26.3 30.29,25.03 20.99,14.82 21.88,15.88 25.48,20.09 24.14,15.77 21.31,13.35 23.83,12.64 16.84,12.95 19.01,15.38 17.86,18.36 38.75,22.54 38.75,26.35 38.75,27.62 38.75,30.16 35.79,34.05 41.33,27.5 41.33,26.23 41.33,24.96 41.33,22.42 41.33,19.88 41.33,17.34 41.33,14.8 33.72,10.46 29.24,20.83 29.08,23.3 32.09,19.57 28.12,12.74 29.26,11.89
  pour Top: 54.61,49.53 54.61,-3.81 -5.08,-3.81 -5.08,49.53
  pour Bottom: 55.88,49.53 55.88,-2.54 -6.35,-2.54 -6.35,49.53
INT4  (via drill 0.3)
  Top 0.152: v28.19,10.36 28.19,9.6 28.73,9.07 28.73,8 U$1.P6 | v22.02,18.44 22.02,19.66 U2.5
  Bottom 0.152: v22.02,18.44 22.02,16.54 v28.19,10.36
INT5  (via drill 0.3)
  Top 0.152: v23.16,21.11 22.86,20.8 22.86,19.74 U2.6 | v27.05,24.99 27.05,25.91 27.58,26.44 27.58,28.57 v25.91,30.25
  Bottom 0.152: v27.05,24.99 v23.16,21.11 | v25.91,30.25 25.91,32.31 23.93,34.29 23.93,35.43 22.33,37.03 22.33,37.41 21.72,38.02 20.5,38.02 19.51,37.03 18.82,37.03 U$2.P6
N$5
  Top 0.152: D2.A 32.77,8 32.77,12.12 33.91,13.26 33.91,14.82 32.54,16.19 R2.1
SCL  (via drill 0.3)
  Top 0.152: U2.22 20.42,28.12 20.42,28.73 21.03,29.34 23.01,29.34 23.93,30.25 23.93,36.88 23.85,36.96 U$2.P4 | U$1.P4 23.77,8 24.38,8 29.03,12.65 29.03,19.43 30.1,20.5 30.18,20.5 30.56,20.88 R11.1 30.48,20.88 v29.64,21.72
  Bottom 0.152: v29.64,21.72 29.64,23.62 27.43,25.83 27.13,25.83 26.52,26.44 26.52,32.16 26.06,32.61 26.06,34.75 23.85,36.96 U$2.P4
SCL_SENSOR0  (via drill 0.3)
  Top 0.152: R6.1 33.53,27.51 33.53,27.81 v32.54,28.8 32.54,28.73 27.36,23.55 25.83,23.55 U2.12 | U$4.P3 37.19,17.07 37.19,18.14 38.18,19.13 38.18,30.71 U$18.P4
  Bottom 0.152: U$18.P4 37.11,31.7 35.2,29.79 32.54,29.79 v32.54,28.8
SCL_SENSOR1  (via drill 0.3)
  Top 0.152: v10.13,15.24 R4.1 | v19.96,26.29 22.4,26.29 23.55,27.43 23.55,28.04 U2.18 | U$8.P3 7.92,14.78 7.92,15.93 7.01,16.84 7.01,26.21 8,27.2 U$21.P4
  Bottom 0.152: v10.13,15.24 8.46,15.24 8,14.78 U$8.P3 | v19.96,26.29 9.37,26.29 8.46,27.2 8.08,27.2 U$21.P4
SDA  (via drill 0.3)
  Top 0.152: v21.26,26.82 21.26,28.04 U2.21 | v32.54,25.07 32.54,24.92 30.63,23.01 R10.1
  Bottom 0.152: U$2.P5 21.34,36.96 21.34,35.74 22.63,34.44 22.63,32.46 21.26,31.09 v21.26,26.82 25.68,26.82 26.98,25.53 27.28,25.53 28.51,24.3 28.51,20.03 30.1,18.44 31.47,18.44 | v32.54,25.07 32.54,24.92 31.47,23.85 31.47,18.44 | 31.47,18.44 31.47,10.06 30.5,9.09 27.34,9.09 U$1.P5
SDA_SENSOR0  (via drill 0.35)
  Top 0.152: R5.1 33.53,32.54 32.16,32.54 30.4,34.29 30.4,36.42 30.25,36.58 30.25,37.49 31.17,38.41 31.47,38.41 32,37.87 32,37.72 32.54,37.19 33.22,37.19 33.6,36.8 33.98,36.8 34.37,36.42 34.37,36.04 34.82,35.59 35.74,35.59 37.11,34.21 U$18.P5 37.24,34.21 38.27,33.19 38.27,32.52 39.34,31.45 39.34,21.97 v38.73,21.36 | U2.11 25.83,22.71 29.49,22.71 30.48,21.72 33.15,21.72 33.76,21.11 35.59,21.11 37.11,19.58 U$4.P4
  Bottom 0.152: U$4.P4 38.73,21.14 v38.73,21.36
SDA_SENSOR1  (via drill 0.3)
  Top 0.152: v10.13,12.65 11.81,12.65 R1.1 | v22.63,25.76 24.38,27.51 24.38,28.04 U2.17 | v8.76,26.14 8.76,25.45 8.08,24.77 U$21.P5 8.08,24.69 8.99,23.77 8.99,14.33 8,13.34 8,12.27 U$8.P4
  Bottom 0.152: v10.13,12.65 8.46,12.65 8.08,12.27 8.02,12.27 U$8.P4 | v22.63,25.76 14.1,25.76 13.87,25.98 8.91,25.98 v8.76,26.14
SWCLK  (via drill 0.3)
  Top 0.152: v15.47,22.94 16.46,21.95 17.37,21.95 U2.31
  Bottom 0.152: TP1.P$1 3.81,22.71 2.82,23.7 2.82,24.54 3.89,25.6 13.79,25.6 14.94,24.46 14.94,23.55 14.9,23.51 | 14.9,23.51 14.25,22.86 JP5.4 | 14.9,23.51 v15.47,22.94
SWDIO
  Top 0.152: U2.32 17.37,21.18 16.46,21.18 14.94,22.71 14.94,23.39 14.25,24.08 JP5.2
  Bottom 0.152: TP2.P$1 3.81,24.08 7.39,24.08 7.7,23.77 11.51,23.77 12.65,24.92 13.41,24.92 14.17,24.16 JP5.2
USB_D_N
  Top 0.254: J1.2 10.81,38.93 10.69,38.93 10.69,37.53 18.46,29.76 18.54,29.76 18.78,29.52 18.79,29.52 19.59,28.72 U2.23
USB_D_P
  Top 0.254: J1.3 10.16,38.93 10.28,38.93 10.28,37.36 18.25,29.39 18.25,28.64 U2.24
VBUS  (via drill 0.35)
  Top 0.254: R15.1 20.73,30.1 20.73,31.55 U4.1 20.65,31.7 20.65,32.38 20.65,32.49
  Top 0.33: v17.06,34.62 16.9,34.77 16.14,34.77 C11.1 12.28,38.64 12.21,38.64 11.69,39.16 | 20.65,32.49 v20.89,32.73 | J1.1 11.69,40.09 11.69,39.16 | 11.69,39.16 11.43,39.42 v11.43,41.66 | v3.81,40.64 3.81,40.23 JP1.1
  Bottom 0.33: v17.06,34.62 19.18,34.62 20.98,32.82 v20.89,32.73 | v11.43,41.66 7.86,41.66 7.82,41.62 4.79,41.62 v3.81,40.64
VDDANA  (via drill 0.3)
  Top 0.152: v16.76,16.31 15.62,16.31 C4.1 | U2.9 25.76,21.11 v23.93,21.11 23.93,21.57 16.69,28.8 15.32,28.8 L1.2
  Bottom 0.152: v16.76,16.31 19.13,16.31 v23.93,21.11
VDDCORE
  Top 0.152: C16.1 12.72,27.05 13.26,27.05 16.76,23.55 17.37,23.55 U2.29
XTAL1
  Top 0.152: C17.1 18.14,16.31 17.83,16.61 X2.P$1 17.83,16.69 18.75,17.6 18.75,19.66 U2.1
XTAL2
  Top 0.152: C18.1 19.96,14.48 19.96,16.38 20.19,16.61 X2.P$2 20.19,16.69 19.66,17.22 19.66,19.66 U2.2

### Text on the board
_tsilk: Port A | BP: | 5V: | Service / only | Sensor A1 | RobotPatient.com | Sensor B2 | Sensor A2 | Sensor B1 | PWR | HB | Health | Reset | Port B
_bsilk: Cortex M0 / SAMD21 | RobotPatient.com | Designed for / ManikinOS